# Altium schematic sheet Power_Diagram.SchDoc: AC POWER METER
size 420 x 297 mm; DrawnBy: Truong Giang; DocumentNumber: Learning
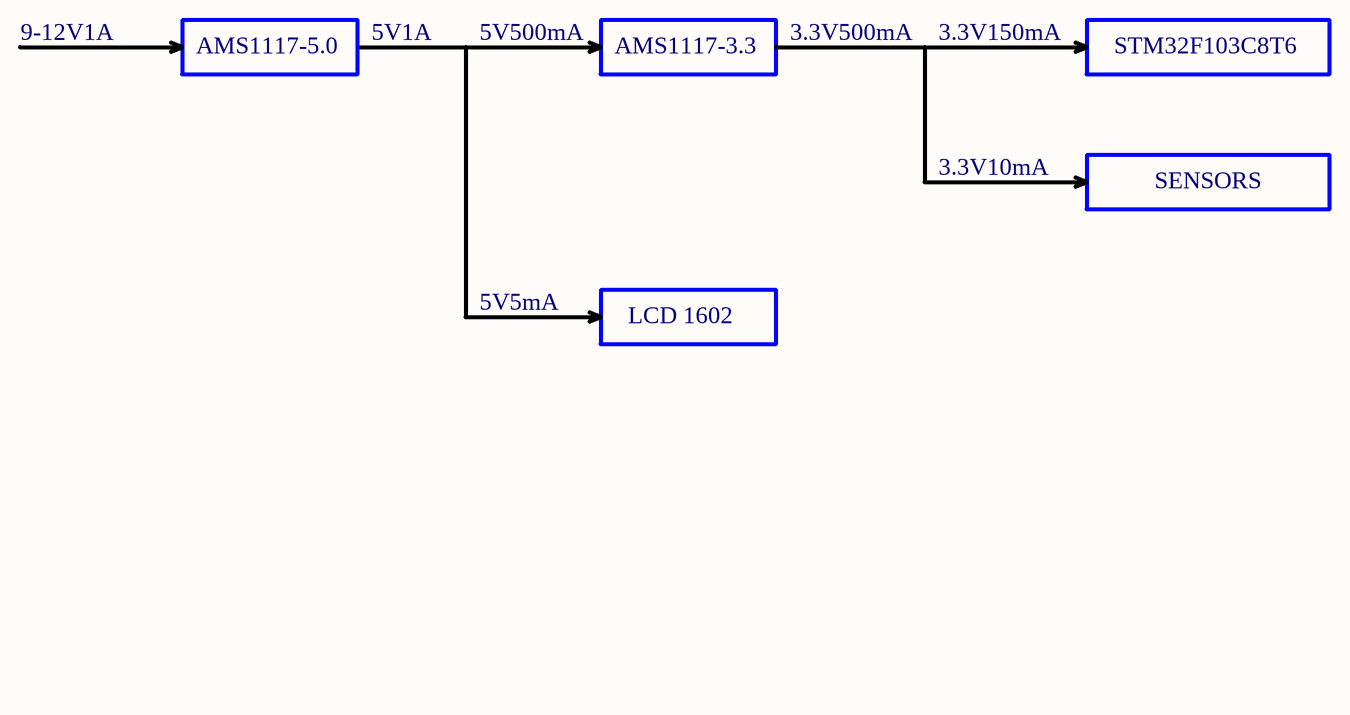
[diagram p0: Power_Diagram.SchDoc]

## Notes on the sheet
- 9-12V1A
- AMS1117-5.0
- 5V1A
- 5V500mA
- AMS1117-3.3
- 3.3V500mA
- 3.3V150mA
- STM32F103C8T6
- 3.3V10mA
- SENSORS
- 5V5mA
- LCD 1602
- PROJECT
- TITLE
- DRAWN BY
- SIZE
- FILE NAME
- SHEET
- OF
- A3